# EasyEDA Pro project ASTROPET_DISPLAY_SOURCE.epro, board PCB1
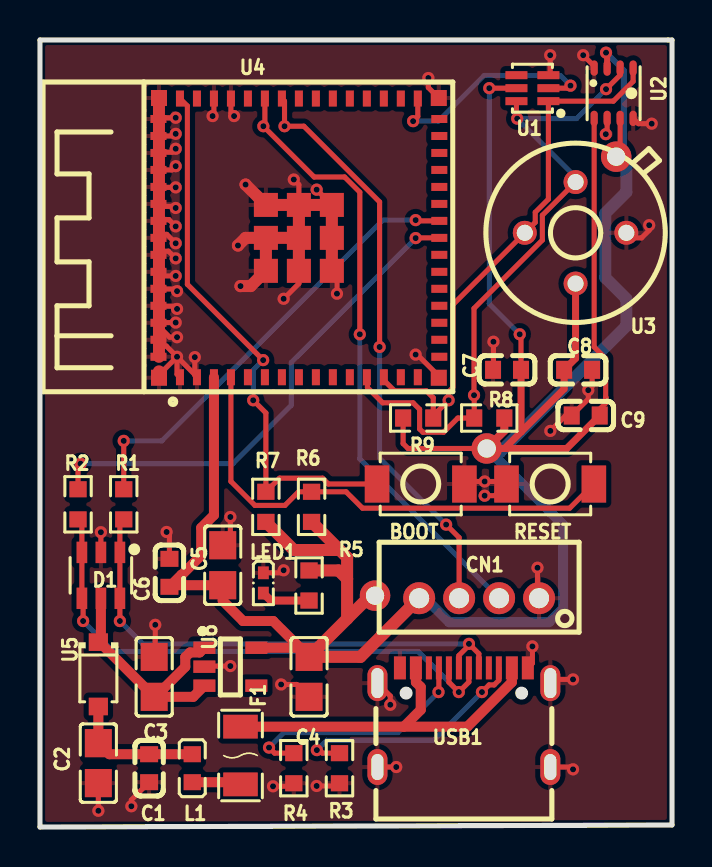
[diagram p2: board, top side]
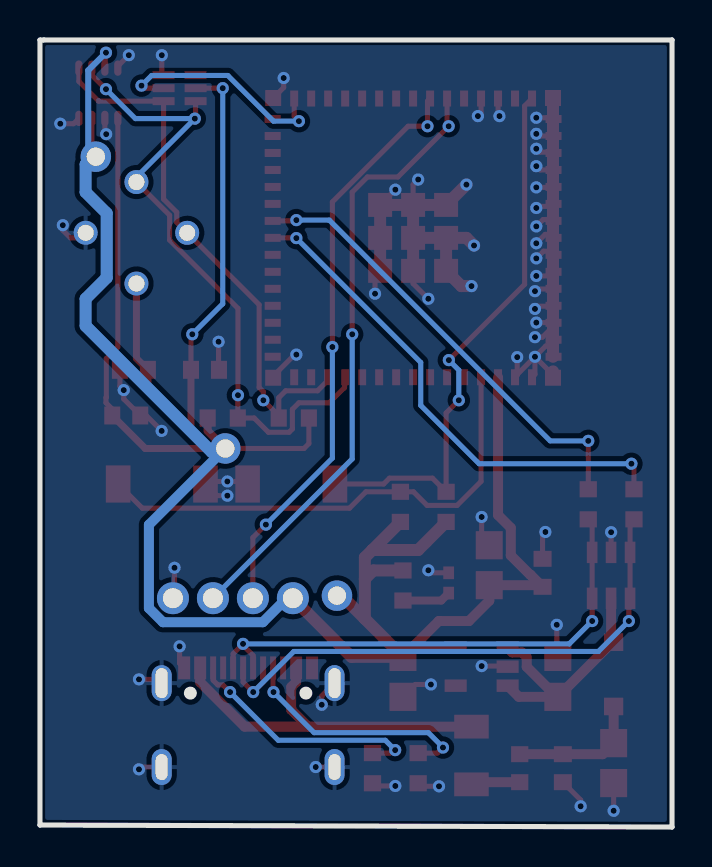
[diagram p3: board, bottom side, seen from below]

Outline 31.62 x 39.39 mm; copper layers: Top Layer, Bottom Layer. Coordinates in mm from the lower left corner of the outline.
Outline path: 0,39.39 0,0 31.62,0.1 31.62,39.39 31.43,39.39 0,39.39
Stack: Top Layer 0.035mm / Dielectric1 1.51mm FR4 er 4.5 / Bottom Layer 0.035mm

## Design rules (mm)
template: JLCPCB Capability(Two Layers Board)
spacing copperThickness1oz (default): track to track 0.102, other pairs 0.152 to 0.3
spacing copperThickness2oz: track to track 0.203, other pairs 0.152 to 0.3
track width copperThickness1oz (default): min 0.127, default 0.254, max 2.54
track width copperThickness2oz: min 0.203, default 0.254, max 2.54
differential pair differentialPair (default): width min 0.127, default 0.254, max 2.54; gap min 0.152, default 0.152
via viaSize (default): diameter min 0.5, default 0.61, max 10; hole min 0.3, default 0.305, max 6.3

## Placement (name value [footprint] x y rotation side)
BOOT  boot switch  [SW-SMD_L3.9-W3.0-P4.45]  19.05 17.17 0 top
C1  100nF  [C0603]  5.46 2.94 270 top
C2  47uF  [C0805]  2.92 3.2 270 top
C3  10uF  [C0805]  5.72 7.52 270 top
C4  22uF  [C0805]  13.46 7.52 90 top
C5  47uF  [C0805]  9.14 13.11 90 top
C6  100nF  [C0603]  6.48 12.72 90 top
C7  100nF  [C0603]  23.37 22.88 0 top
C8  100nF  [C0603]  26.92 22.88 180 top
C9  100nF  [C0603]  27.31 20.6 0 top
CN1  gps connector  [CONN-TH_B4B-PH-K-S]  21.97 11.45 0 top
D1  USBLC6-2SC6  [SOT-23-6_L2.9-W1.6-P0.95-LS2.8-BL]  3.05 12.6 180 top
F1  JK-NSMD075  [F1206]  10.03 3.58 270 top
L1  BLM18PG121SN1D  [L0603]  7.62 2.94 90 top
LED1  APHHS1005LSECK/J3-PF  [LED0402-RD_RED]  11.18 12.22 270 top
NOREF  -  [Pad_e472]  16.76 11.58 0 top
NOREF#2  -  [Pad_e764]  28.83 33.55 0 top
NOREF#3  -  [Pad_e478]  22.35 18.95 0 top
R1  22Ω  [R0603]  4.19 16.15 90 top
R2  22Ω  [R0603]  1.91 16.15 90 top
R3  5.1kΩ  [R0603]  14.99 2.94 270 top
R4  5.1kΩ  [R0603]  12.7 2.94 270 top
R5  10kΩ  [R0603]  13.46 12.09 270 top
R6  10kΩ  [R0603]  13.59 16.03 90 top
R7  10kΩ  [R0603]  11.3 16.03 90 top
R8  4.3kΩ  [R0603]  22.48 20.47 0 top
R9  4.3kΩ  [R0603]  18.92 20.47 0 top
RESET  reset switch  [SW-SMD_L3.9-W3.0-P4.45]  25.53 17.17 180 top
U1  TSL2591  [DFN-6_L2.4-W2.0-P0.65-BL]  24.64 36.98 90 top
U2  BME280  [LGA-8_BME280_BL]  28.7 36.73 90 top
U3  MLX90614  [TO-39-4_MELEXIS_MLX90614XXA]  26.8 29.74 0 top
U4  2.4GHz  [BULETM-SMD_ESP32-S3-MINI-1-N8]  12.95 29.49 90 top
U5  MBR0520  [SOD-123_L2.7-W1.6-LS3.7-RD-A]  2.92 7.64 270 top
U6  AP2112K-3.3TRG1  [SOT-25-5_L2.9-W1.6-P0.95-LS2.8-BL]  9.53 8.02 270 top
USB1  TYPEC-304J-BCP16  [USB-C-SMD_TYPEC-304J-BCP16]  21.21 5.48 0 top

## Footprints (pads in the part's own frame, mm; a bottom-side part is the same pattern mirrored in y, then rotated)
BULETM-SMD_ESP32-S3-MINI-1-N8
  rect 0.8x0.4 smd: 1(-6.975,5.95) 2(-6.975,5.1) 3(-6.975,4.25) 4(-6.975,3.4) 5(-6.975,2.55) 6(-6.975,1.7) 7(-6.975,0.85) 8(-6.975,0) 9(-6.975,-0.85) 10(-6.975,-1.7) 11(-6.975,-2.55) 12(-6.975,-3.4) 13(-6.975,-4.25) 14(-6.975,-5.1) 15(-6.975,-5.95) 31(6.975,-5.95) 32(6.975,-5.1) 33(6.975,-4.25) 34(6.975,-3.4) 35(6.975,-2.55) 36(6.975,-1.7) 37(6.975,-0.85) 38(6.975,0) 39(6.975,0.85) 40(6.975,1.7) 41(6.975,2.55) 42(6.975,3.4) 43(6.975,4.25) 44(6.975,5.1) 45(6.975,5.95)
  rect 0.4x0.8 smd: 16(-5.95,-7.025) 17(-5.1,-7.025) 18(-4.25,-7.025) 19(-3.4,-7.025) 20(-2.55,-7.025) 21(-1.7,-7.025) 22(-0.85,-7.025) 23(0,-7.025) 24(0.85,-7.025) 25(1.7,-7.025) 26(2.55,-7.025) 27(3.4,-7.025) 28(4.25,-7.025) 29(5.1,-7.025) 30(5.95,-7.025) 46(5.95,7.025) 47(5.1,7.025) 48(4.25,7.025) 49(3.4,7.025) 50(2.55,7.025) 51(1.7,7.025) 52(0.85,7.025) 53(0,7.025) 54(-0.85,7.025) 55(-1.7,7.025) 56(-2.55,7.025) 57(-3.4,7.025) 58(-4.25,7.025) 59(-5.1,7.025) 60(-5.95,7.025)
  rect 0.8x0.8 smd: GND(-7,7) GND(-7,-7) GND(7,7) GND(7,-7)
  rect 1.2x1.2 smd: GND(-1.65,1.65) GND(-1.65,0) GND(-1.65,-1.65) GND(0,1.65) GND(0,0) GND(0,-1.65) GND(1.65,1.65) GND(1.65,0) GND(1.65,-1.65)
C0603
  rect 0.8x0.9 smd: 1(-0.7,0) 2(0.7,0)
C0805
  rect 1.41x1.35 smd: 1(-1,0) 2(1,0)
CONN-TH_B4B-PH-K-S
  round 1.6 hole 1: 1(3,0) 2(1,0) 3(-1,0) 4(-3,0)
DFN-6_L2.4-W2.0-P0.65-BL
  rect 0.4x1.1 smd: 1(-0.65,-0.8) 2(0,-0.8) 3(0.65,-0.8) 4(0.65,0.8) 5(0,0.8) 6(-0.65,0.8)
F1206
  rect 1.19x1.728 smd: 1(-1.445,0) 2(1.445,0)
L0603
  rect 0.8x0.864 smd: 1(-0.7,0) 2(0.7,0)
LED0402-RD_RED
  rect 0.636x0.54 smd: 1(-0.508,0) 2(0.508,0)
LGA-8_BME280_BL
  oval 0.767x0.364 smd: 1(1.258,0.975) 2(1.258,0.325) 3(1.258,-0.325) 4(1.258,-0.975) 5(-1.258,-0.975) 6(-1.258,-0.325) 7(-1.258,0.325) 8(-1.258,0.975)
Pad_e472
  round 1.524 hole 0.914: 1(0,0)
Pad_e478
  round 1.524 hole 0.914: 1(0,0)
Pad_e764
  round 1.524 hole 0.914: 1(0,0)
R0603
  rect 0.806x0.864 smd: 1(-0.753,0) 2(0.753,0)
SOD-123_L2.7-W1.6-LS3.7-RD-A
  rect 0.88x0.96 smd: 1(-1.61,0) 2(1.61,0)
SOT-23-6_L2.9-W1.6-P0.95-LS2.8-BL
  rect 0.532x1.072 smd: 1(-0.95,-1.149) 2(0,-1.149) 3(0.95,-1.149) 4(0.95,1.149) 5(0,1.149) 6(-0.95,1.149)
SOT-25-5_L2.9-W1.6-P0.95-LS2.8-BL
  rect 0.623x1.105 smd: 1(-0.95,-1.3) 2(-0.001,-1.3) 3(0.95,-1.3) 4(0.95,1.3) 5(-0.95,1.3)
SW-SMD_L3.9-W3.0-P4.45
  rect 1.23x1.86 smd: 1(-2.185,0) 2(2.185,0)
TO-39-4_MELEXIS_MLX90614XXA
  round 1.2 hole 0.8: 1(0,2.54) 2(-2.54,0) 3(0,-2.54) 4(2.54,0)
USB-C-SMD_TYPEC-304J-BCP16
  oval 1x1.8 hole 0.6x1.5: 13(-4.325,1.718) 14(4.325,1.718)
  oval 1x1.8 hole 0.6x1.3: 15(-4.325,-2.482) 16(4.325,-2.482)
  rect 0.6x1.15 smd: A1B12(-3.2,2.482) A4B9(-2.4,2.482) B1A12(3.2,2.482) B4A9(2.4,2.482)
  rect 0.3x1.15 smd: A5(-1.25,2.482) A6(-0.25,2.482) A7(0.25,2.482) A8(1.25,2.482) B5(1.75,2.482) B6(0.75,2.482) B7(-0.75,2.482) B8(-1.75,2.482)

## Nets
As in the schematic, except:
3V3: C4.2 C5.1 C6.1 C7.2 C8.2 C9.2 CN1.4 NOREF.1 NOREF#2.1 NOREF#3.1 R5.1 R6.1 R7.1 R8.2 R9.1 U1.5 U2.2 U2.6 U2.8 U3.3 U4.3 U6.5

Pads without a net: U1 4; U4 5 6 7 8 9 10 11 14 15 16 17 18 19 20 21 22 25 26 27 28 29 30 32 33 34 35 36 37 38 41 44; U6 4; USB1 A8 B8

## Via types
v1: diameter 0.61, hole 0.305, Top Layer to Bottom Layer, 82 vias

## Routing (per net, layer and track width the routed paths; a pad name or vN(x,y) marks a point on that pad's centre or on a via; arc(x,y) is an arc through that point)
3V3: length 148.4
  Top Layer w0.254: C9.2 28,20.92 28.32,21.23 28.32,21.49 28.3,21.5 28.3,23.45 27.73,24.03 U2.8 ; 28.83,33.68 29.03,33.88 U2.6 ; U1.5 v1(22.48,36.98) ; C7.2 24.07,24.6 v1(24,24.66) ; NOREF#3.1 18.41,18.95 18.17,19.19 R9.1
  Top Layer w0.3: U2.2 28.38,38.7 v1(28.32,38.76)
  Top Layer w0.35: 23.24,18.95 NOREF#3.1 ; 23.24,18.95 24.07,19.77 ; 23.24,18.95 26.35,18.95 27.88,20.47 ; 24.07,19.77 C7.2 ; 24.07,19.77 26.22,21.93 C8.2 26.8,23.46 U3.3
  Top Layer w0.4: NOREF#3.1 23.23,19.83 R8.2
  Top Layer w0.5: 6.56,12.11 C6.1 ; 6.56,12.11 7.07,12.62 7.09,12.62 8.07,13.6 8.07,14.98 8.7,15.61 U4.3 ; 6.56,12.11 C5.1 9.14,11.33 10.16,10.31 11.67,10.31 13,8.97 U6.5
  Top Layer w0.6: 15.37,10.42 C4.2 16.03,8.52 CN1.4 ; 15.37,10.42 15.37,12.42 ; 15.37,10.42 16.53,11.58 NOREF.1 ; 15.37,12.42 15.37,13.49 14.99,13.87 ; 15.37,12.42 14.94,12.84 R5.1 ; R7.1 11.3,15.26 12.7,13.87 14.99,13.87 ; 14.99,13.87 R6.1
  Bottom Layer w0.254: v1(22.48,36.98) 22.48,26.19 v1(24,24.66)
  Bottom Layer w0.3: v1(28.32,38.76) 29.21,37.87 29.21,34.06 28.83,33.68
  Bottom Layer w0.5: CN1.4 19.27,11.45 20.47,10.25 25.47,10.25 26.17,10.96 26.17,15.13 NOREF#3.1
  Bottom Layer w0.6: 28.83,33.68 29.34,33.17 29.34,31.77 28.28,30.72 28.28,27.49 29.34,26.44 29.34,25.08 23.03,18.77 22.52,18.77 22.35,18.6 NOREF#3.1
5V: length 12.7
  Top Layer w0.5: 5.77,6.52 7.67,6.52 U6.3 ; 5.77,6.52 7.27,8.02 7.27,8.5 7.51,8.74 7.99,8.74 U6.1 ; 5.77,6.52 C3.2 2.98,9.25 U5.1 3.05,9.38 D1.5
GND: length 96.7
  Top Layer w0.254: v1(13.84,2.06) 14.85,2.06 R3.2 ; v1(13.84,31.9) 14.6,31.14 ; 5.95,25.3 6,25.25 v1(6.79,25.25) ; v1(14.86,26.69) 14.86,27.58 U4.GND ; C8.1 27.62,22.06 v1(27.43,21.87) 27.43,21.42 C9.1 26.3,20.6 v1(25.53,19.83) ; U4.1 6.86,22.66 v1(6.86,23.54) ; v1(6.79,29.22) 6.34,29.66 5.95,29.66 ; 5.95,33.78 6.62,33.78 v1(6.79,33.95) ; 5.95,24.08 6.32,24.08 v1(6.86,23.54) ; 5.95,25.05 6.48,24.52 v1(6.86,24.52) ; v1(6.79,27.58) 6.16,27.58 5.95,27.79 ; U2.7 28.38,34.74 v1(28.31,34.68) ; 5.95,26.93 6.75,26.93 v1(6.86,26.82) ; USB1.13 17.53,6.56 v1(17.53,6.12) ; v1(6.86,23.54) 7.75,22.65 ; v1(6.86,23.54) 6.13,22.81 5.95,22.81 ; U4.2 7.75,22.62 7.75,22.65 ; v1(30.61,35.2) 29.94,35.2 U2.5 ; v1(9.53,8.06) 8.26,8.06 U6.2 ; v1(26.67,2.89) 26.55,3 USB1.16 ; v1(6.79,30.98) 6.71,31.06 5.95,31.06 ; 5.95,28.82 6.43,28.82 v1(6.79,28.46) ; U2.1 27.73,38.08 v1(27.18,38.63) ; U4.43 8.7,35.65 v1(8.64,35.58) ; v1(3.05,14.76) D1.2 ; 5.95,30.4 6.45,30.4 v1(6.79,30.06) ; 7.75,22.65 v1(7.75,23.52) ; v1(22.25,16.58) 22.76,16.58 RESET.2 23.22,17.3 v1(22.25,17.3) 21.36,17.3 BOOT.2 ; 5.95,35.45 6,35.5 v1(6.79,35.5) ; v1(12.19,26.44) 12.95,27.2 U4.GND ; v1(6.34,14.77) 6.48,14.63 C6.2 ; v1(24.89,12.98) 24.89,11.53 CN1.1 ; U4.GND 19.43,37.01 v1(19.43,37.49) ; v1(24.64,9.04) 24.64,8.2 USB1.B1A12 ; v1(30.48,30.12) 30.48,29.87 30.1,29.49 29.59,29.49 U3.4 ; C3.1 5.77,8.57 v1(5.77,10.12) ; v1(11.66,2.04) 12.55,2.04 R4.2 ; v1(12.7,32.41) 12.95,32.16 U4.GND ; v1(9.71,35.58) 9.55,35.74 U4.42 ; v1(4.57,1.04) 4.57,1.36 C1.2 ; v1(22.69,24.29) 22.69,22.9 C7.1 ; C2.2 v1(2.92,0.81) ; v1(12.06,7.14) 12.84,7.14 C4.1 ; v1(6.86,25.93) 6.72,26.07 5.95,26.07 ; v1(18.8,23.65) 18.88,23.65 19.95,22.57 U4.GND ; v1(6.79,34.69) 6.68,34.59 U4.47 ; 5.95,31.94 6.03,32.02 v1(6.79,32.02) ; v1(12.19,12.85) 12.07,12.72 LED1.1 ; v1(9.53,15.52) 9.53,14.49 C5.2 ; USB1.14 25.72,7.39 v1(26.67,7.39) ; v1(25.53,38.63) 25.53,37.72 25.44,37.63 ; U4.49 6.6,32.89 v1(6.79,33.08) ; USB1.15 v1(17.83,3)
  Top Layer w0.6: 5.95,23.54 5.95,25.05 ; 5.95,25.3 U4.GND ; U4.GND U4.GND ; U4.GND 11.3,31.14 v1(10.29,32.16) ; U4.GND U4.GND U4.GND U4.GND ; U4.GND U4.GND ; U4.GND 11.3,29.49 ; 11.3,29.49 11.3,27.84 10.54,27.08 v1(10.03,27.08) ; 11.3,29.49 10.29,29.49 v1(9.91,29.11) ; 5.95,22.81 U4.GND
VBUS: length 18.6
  Top Layer w0.5: 18.21,5.02 21.38,5.02 23.61,7.25 USB1.B4A9 ; 18.21,5.02 19.05,5.87 19.05,7.01 18.81,7.25 USB1.A4B9 ; 18.21,5.02 F1.1
BOOT: length 27.8
  Top Layer w0.254: v1(11.17,23.37) 7.38,27.16 7.38,36.09 U4.45 ; BOOT.1 14.43,17.17 14.14,17.46 11.98,17.46 R7.2 11.3,20.72 v1(10.67,21.36)
  Bottom Layer w0.254: v1(11.17,23.37) 10.67,22.87 v1(10.67,21.36)
D+: length 22.8
  Top Layer w0.254: R1.2 v1(4.19,19.33) ; v1(18.8,30.38) 18.83,30.34 U4.24
  Bottom Layer w0.254: v1(18.8,30.38) 17.14,30.38 6.1,19.33 v1(4.19,19.33)
D-: length 25
  Top Layer w0.254: v1(18.8,29.48) 18.81,29.49 U4.23 ; R2.2 1.91,18.06 v1(2.03,18.19)
  Bottom Layer w0.254: 2.29,18.19 9.65,18.19 12.57,21.11 12.57,23.25 v1(18.8,29.48)
DN: length 28.3
  Top Layer w0.254: R2.1 2.1,15.21 2.1,11.45 2.16,11.39 v1(2.16,10.31) ; USB1.A7 21.46,7.26 v1(20.95,6.75) 20.46,7.25 USB1.B7
  Bottom Layer w0.254: v1(20.95,6.75) 18.92,8.79 3.68,8.79 v1(2.16,10.31)
DP: length 25.9
  Top Layer w0.254: 4,10.31 D1.6 D1.1 4,15.21 R1.1 ; USB1.B6 21.96,8.67 v1(21.46,9.17) 21.46,9.09 20.96,8.59 USB1.A6
  Bottom Layer w0.254: v1(21.46,9.17) 5.14,9.17 v1(4,10.31)
INT: length 11.4
  Top Layer w0.254: 25.44,36.98 26.42,36.98 v1(26.54,37.11) ; v1(18.67,35.33) 18.9,35.56 18.9,36.46
  Bottom Layer w0.254: v1(18.67,35.33) 19.94,35.33 22.22,37.62 26.03,37.62 v1(26.54,37.11)
RESET: length 25
  Top Layer w0.254: RESET.1 26.5,15.96 16.13,15.96 15.31,16.78 R6.2 12.94,16.78 12.25,16.1 10.76,16.1 9.55,17.3 U4.4
RX: length 29.2
  Top Layer w0.254: v1(16.99,24.03) 16.99,31.29 13.2,35.08 v1(12.23,35.08) 12.23,36.33 U4.39 ; v1(20.32,15.14) 20.97,14.49 CN1.3
  Bottom Layer w0.254: v1(16.99,24.03) 16.99,18.46 v1(20.32,15.14)
SCL: length 27.4
  Top Layer w0.254: 19.68,20.68 19.76,20.68 v1(20.45,21.36) 20.45,21.79 20.66,22 20.66,26.14 U3.2 24.78,30.27 24.78,30.77 25.44,31.43 25.44,36.33 28.69,36.33 29.68,37.32 U2.4
  Top Layer w0.255: R9.2 19.68,21.49 19.33,21.83 17.74,21.83 17.2,22.37 U4.13
SDA: length 33.3
  Top Layer w0.254: v1(28.32,36.93) 29.03,37.64 U2.3 ; v1(23.88,35.46) 23.84,35.49 U1.6 ; U3.1 25.14,30.62 25.14,29.38 21.72,25.96 v1(21.72,21.61) 21.73,21.61 R8.1 20.91,20.47 20.19,19.76 19.16,19.76 18.99,19.92 18.99,20.91 18.67,21.23 17.14,21.23 16.38,21.99 16.38,22.48 U4.12
  Bottom Layer w0.254: v1(28.32,36.93) 26.85,35.46 v1(23.88,35.46) 26.8,32.54 U3.1
TX: length 30.8
  Top Layer w0.254: U4.40 11.25,35.15 v1(11.18,35.08) 13.72,32.54 15.24,32.54 16,31.77 v1(16,24.66)
  Bottom Layer w0.254: CN1.2 16,18.42 v1(16,24.66)
$1N6486: length 12.4
  Top Layer w0.254: v1(13.85,3.85) 13.98,3.85 14.13,3.7 R3.1 ; v1(22.11,6.75) 22.47,7.11 22.72,7.11 22.96,7.35 USB1.B5
  Bottom Layer w0.254: v1(22.11,6.75) 19.7,4.34 14.34,4.34 v1(13.85,3.85)
$1N6491: length 12.2
  Top Layer w0.254: v1(11.46,3.98) 11.74,3.7 R4.1 ; USB1.A5 19.96,6.77 v1(19.94,6.75)
  Bottom Layer w0.254: v1(19.94,6.75) 17.91,4.72 12.19,4.72 11.46,3.99 v1(11.46,3.98)
$1N6871: length 2.5
  Top Layer w0.5: L1.1 9.92,2.24 10.03,2.13
$1N6907: length 6.8
  Top Layer w0.5: U5.2 C2.1 3.47,3.64 C1.1 L1.2
$1N7993: length 2.4
  Top Layer w0.4: LED1.2 11.55,11.34 R5.2

## Copper pours and planes (outline as drawn; the poured copper is in the pictures)
GND on Top Layer: 0,39.39 31.62,39.39 31.62,0.1 0,0.1
GND on Bottom Layer: 0,39.39 31.62,39.39 31.62,0.1 0,0.1
